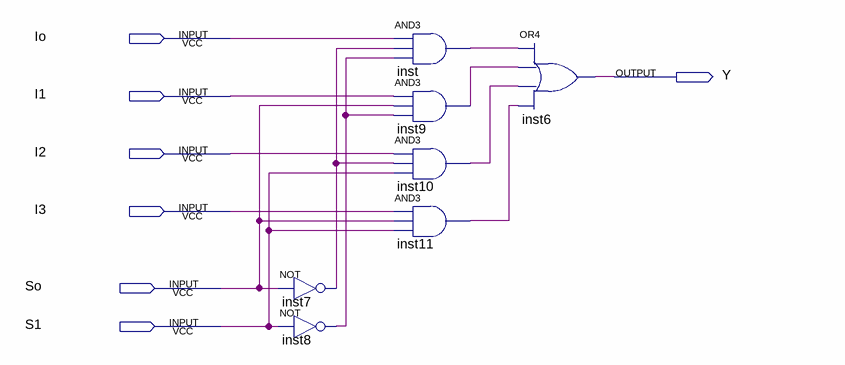
[diagram p0: schematic sheet]
// Quartus schematic Multiplexor_USE.bdf as structural Verilog: 7 symbols, 7 pins
module Multiplexor_USE (
  input  Io,
  input  I1,
  input  I2,
  input  I3,
  input  So,
  input  S1,
  output Y
);

  wire inst7_out, inst8_out, inst9_out, inst10_out, inst11_out, inst_out;

  not inst7 (inst7_out, So);
  not inst8 (inst8_out, S1);
  and inst (inst_out, Io, inst7_out, inst8_out);
  and inst9 (inst9_out, I1, So, inst8_out);
  and inst10 (inst10_out, I2, inst7_out, S1);
  and inst11 (inst11_out, I3, So, S1);
  or inst6 (Y, inst_out, inst9_out, inst10_out, inst11_out);
endmodule
